# Altium project Aux_Lights_Daughter_REV2.PrjPcb
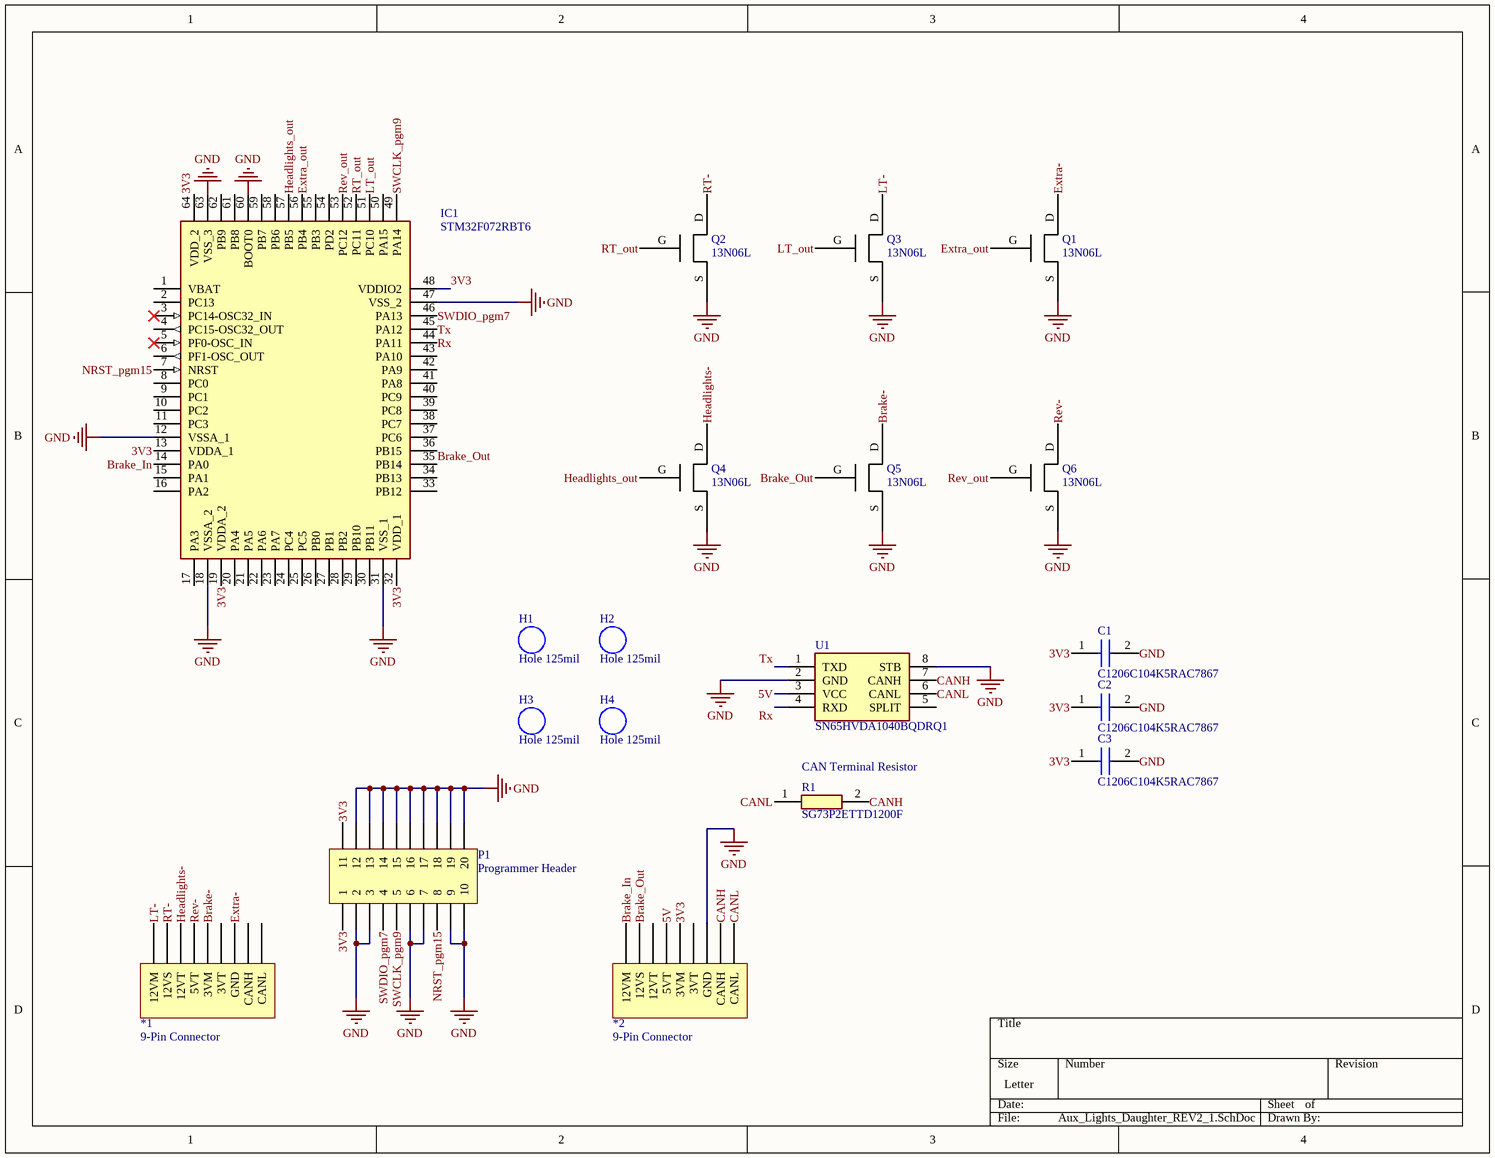
[diagram p0: Aux_Lights_Daughter_REV2_1.SchDoc]
1 sheet, 19 parts. Net scope: global (net labels, ports and power ports of the same name join across sheets).
Board file: Aux_Lights_Daughter_REV2.PcbDoc

## Sheet Aux_Lights_Daughter_REV2_1.SchDoc
size Letter

### Parts
*1  9-Pin Connector  [9-Pin]
*2  9-Pin Connector  [9-Pin]
C1  C1206C104K5RAC7867  [CAPC3216X110N]
C2  C1206C104K5RAC7867  [CAPC3216X110N]
C3  C1206C104K5RAC7867  [CAPC3216X110N]
H1  Hole 125mil  [Hole 125mil]
H2  Hole 125mil  [Hole 125mil]
H3  Hole 125mil  [Hole 125mil]
H4  Hole 125mil  [Hole 125mil]
IC1  STM32F072RBT6  [QFP50P1200X1200X160-64N]
P1  Programmer Header  [HDR2X10_CEN]
Q1  13N06L  [13N06L]
Q2  13N06L  [13N06L]
Q3  13N06L  [13N06L]
Q4  13N06L  [13N06L]
Q5  13N06L  [13N06L]
Q6  13N06L  [13N06L]
R1  SG73P2ETTD1200F  [RESC3226X70N]
U1  SN65HVDA1040BQDRQ1  [SOIC127P600X175-8N]

### Nets
GND: *2.7(GND) C1.2 C2.2 C3.2 IC1.12(VSSA_1) IC1.18(VSSA_2) IC1.31(VSS_1) IC1.47(VSS_2) IC1.60(BOOT0) IC1.63(VSS_3) P1.2 P1.3 P1.6 P1.7 P1.9 P1.10 P1.12 P1.13 P1.14 P1.15 P1.16 P1.17 P1.18 P1.19 P1.20 Q1.S Q2.S Q3.S Q4.S Q5.S Q6.S U1.2(GND) U1.8(STB)
3V3: *2.5(3VM) C1.1 C2.1 C3.1 IC1.13(VDDA_1) IC1.19(VDDA_2) IC1.32(VDD_1) IC1.48(VDDIO2) IC1.64(VDD_2) P1.1 P1.11
5V: *2.4(5VT) U1.3(VCC)
Brake-: *1.5(3VM) Q5.D
Brake_In: *2.1(12VM) IC1.14(PA0)
Brake_Out: *2.2(12VS) IC1.35(PB14) Q5.G
CANH: *2.8(CANH) R1.2 U1.7(CANH)
CANL: *2.9(CANL) R1.1 U1.6(CANL)
Extra-: *1.7(GND) Q1.D
Extra_out: IC1.56(PB4) Q1.G
Headlights-: *1.3(12VT) Q4.D
Headlights_out: IC1.57(PB5) Q4.G
LT-: *1.1(12VM) Q3.D
LT_out: IC1.51(PC10) Q3.G
NRST_pgm15: IC1.7(NRST) P1.8
Rev-: *1.4(5VT) Q6.D
Rev_out: IC1.53(PC12) Q6.G
RT-: *1.2(12VS) Q2.D
RT_out: IC1.52(PC11) Q2.G
Rx: IC1.44(PA11) U1.4(RXD)
SWCLK_pgm9: IC1.49(PA14) P1.5
SWDIO_pgm7: IC1.46(PA13) P1.4
Tx: IC1.45(PA12) U1.1(TXD)

Not connected (* = marked no-connect by the designer): *1 6(3VT) 8(CANH) 9(CANL); *2 3(12VT) 6(3VT); IC1 1(VBAT) 2(PC13) 3(PC14-OSC32_IN)* 4(PC15-OSC32_OUT) 5(PF0-OSC_IN)* 6(PF1-OSC_OUT) 8(PC0) 9(PC1) 10(PC2) 11(PC3) 15(PA1) 16(PA2) 17(PA3) 20(PA4) 21(PA5) 22(PA6) 23(PA7) 24(PC4) 25(PC5) 26(PB0) 27(PB1) 28(PB2) 29(PB10) 30(PB11) 33(PB12) 34(PB13) 36(PB15) 37(PC6) 38(PC7) 39(PC8) 40(PC9) 41(PA8) 42(PA9) 43(PA10) 50(PA15) 54(PD2) 55(PB3) 58(PB6) 59(PB7) 61(PB8) 62(PB9); U1 5(SPLIT)

### Notes on the sheet
- (near R1) CAN Terminal Resistor

### Library data of the parts
C1-C3 = C1206C104K5RAC7867: Capacitor; Manufacturer_Name: Kemet; Datasheet Link: https://componentsearchengine.com/Datasheets/1/C1206C104K5RAC7867.pdf; Height: 1.1mm; Mouser2 Part Number: 80-C1206104K5RAC7867; Mouser2 Price/Stock: https://www.mouser.com/Search/Refine.aspx?Keyword=80-C1206104K5RAC7867; Manufacturer_Part_Number: C1206C104K5RAC7867
IC1 = STM32F072RBT6: Integrated Circuit; Manufacturer_Name: STMicroelectronics; Datasheet Link: https://componentsearchengine.com/Datasheets/1/STM32F072RBT6.pdf; Height: 1.6mm; Mouser Part Number: 511-STM32F072RBT6; Mouser Price/Stock: https://www.mouser.com/Search/Refine.aspx?Keyword=511-STM32F072RBT6; Manufacturer_Part_Number: STM32F072RBT6
P1 = Header 10X2A: Header, 10-Pin, Dual row; LatestRevisionDate: 17-Jul-2002; LatestRevisionNote: Re-released for DXP Platform.; Publisher: Altium Limited
R1 = SG73P2ETTD1200F: Resistor; Manufacturer_Name: KOA Speer; Datasheet Link: https://ms.componentsearchengine.com/Datasheets/1/SG73P2ETTD1200F.pdf; Height: 0.7mm; Manufacturer_Part_Number: SG73P2ETTD1200F
U1 = SN65HVDA1040BQDRQ1: Integrated Circuit; Manufacturer_Name: Texas Instruments; Datasheet Link: http://www.ti.com/lit/gpn/SN65HVDA1040B-Q1; Height: 1.75mm; Manufacturer_Part_Number: SN65HVDA1040BQDRQ1